# Altium schematic sheet Signal-Isolation-Section.SchDoc
size A4; DocumentNumber: 8; SheetNumber: 8; SheetTotal: 10
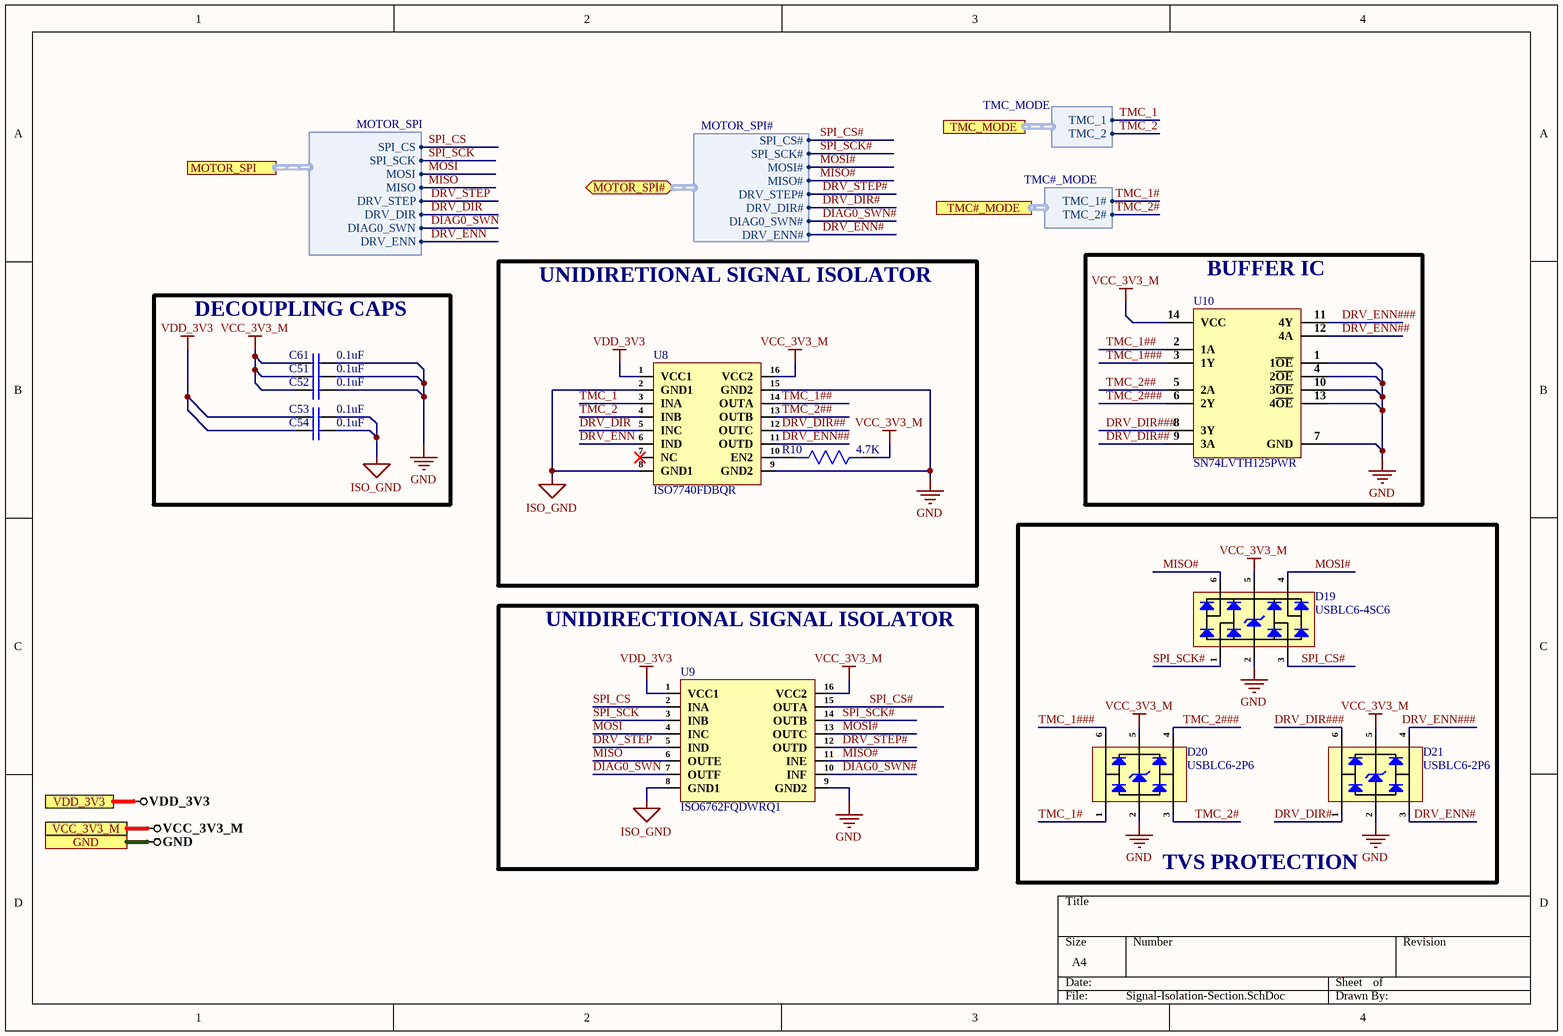
[diagram p0: Signal-Isolation-Section.SchDoc]

## Parts
C51  0.1uF  [Cap 0603]
C52  0.1uF  [Cap 0603]
C53  0.1uF  [Cap 0603]
C54  0.1uF  [Cap 0603]
C61  0.1uF  [Cap 0603]
D19  USBLC6-4SC6  [SOT-23-6]
D20  USBLC6-2P6  [SOT-666]
D21  USBLC6-2P6  [SOT-666]
R10  4.7K  [Res-0201]
U8  ISO7740FDBQR  [16-SSOP]
U9  ISO6762FQDWRQ1  [16-SOIC]
U10  SN74LVTH125PWR  [SN74LVTH125PWR]

## Blocks framed on the sheet
DECOUPLING CAPS: C51-C54 C61
UNIDIRETIONAL SIGNAL ISOLATOR: R10 U8
BUFFER IC: U10
TVS PROTECTION: D19-D21
UNIDIRECTIONAL SIGNAL ISOLATOR: U9

## Ports
GND, MOTOR_SPI (harness MOTOR_SPI), MOTOR_SPI# (bidir, harness MOTOR_SPI#), TMC#_MODE (harness TMC#_MODE), TMC_MODE (harness TMC_MODE), VCC_3V3_M, VDD_3V3

## Harnesses
MOTOR_SPI: SPI_CS, SPI_SCK, MOSI, MISO, DRV_STEP, DRV_DIR, DRV_ENN, DIAG0_SWN
MOTOR_SPI#: SPI_CS#, SPI_SCK#, MOSI#, MISO#, DRV_STEP#, DRV_DIR#, DIAG0_SWN#, DRV_ENN#
TMC_MODE: TMC_1, TMC_2
TMC#_MODE: TMC_1#, TMC_2#

## Nets
GND: C51.2 C52.2 C61.2 D19.2(GND) D20.2(GND) D21.2(GND) U8.9(GND2) U8.15(GND2) U9.9(GND2) U10.1(1~{OE}) U10.4(2~{OE}) U10.7(GND) U10.10(3~{OE}) U10.13(4~{OE}) ; port GND
ISO_GND: C53.2 C54.2 U8.2(GND1) U8.8(GND1) U9.8(GND1)
VCC_3V3_M: C51.1 C52.1 C61.1 D19.5(VBUS) D20.5(VBUS) D21.5(VBUS) R10.1 U8.16(VCC2) U9.16(VCC2) U10.14(VCC) ; port VCC_3V3_M
VDD_3V3: C53.1 C54.1 U8.1(VCC1) U9.1(VCC1) ; port VDD_3V3
DIAG0_SWN: U9.7(OUTF) ; port MOTOR_SPI.DIAG0_SWN
DIAG0_SWN#: U9.10(INF) ; port MOTOR_SPI#.DIAG0_SWN#
DRV_DIR: U8.5(INC) ; port MOTOR_SPI.DRV_DIR
DRV_DIR#: D21.1(I/O1) ; port MOTOR_SPI#.DRV_DIR#
DRV_DIR##: U8.12(OUTC) U10.9(3A)
DRV_DIR###: D21.6(I/O1) U10.8(3Y)
DRV_ENN: U8.6(IND) ; port MOTOR_SPI.DRV_ENN
DRV_ENN#: D21.3(I/O2) ; port MOTOR_SPI#.DRV_ENN#
DRV_ENN##: U8.11(OUTD) U10.12(4A)
DRV_ENN###: D21.4(I/O2) U10.11(4Y)
DRV_STEP: U9.5(IND) ; port MOTOR_SPI.DRV_STEP
DRV_STEP#: U9.12(OUTD) ; port MOTOR_SPI#.DRV_STEP#
MISO: U9.6(OUTE) ; port MOTOR_SPI.MISO
MISO#: D19.6(I/O4) U9.11(INE) ; port MOTOR_SPI#.MISO#
MOSI: U9.4(INC) ; port MOTOR_SPI.MOSI
MOSI#: D19.4(I/O3) U9.13(OUTC) ; port MOTOR_SPI#.MOSI#
SPI_CS: U9.2(INA) ; port MOTOR_SPI.SPI_CS
SPI_CS#: D19.3(I/O2) U9.15(OUTA) ; port MOTOR_SPI#.SPI_CS#
SPI_SCK: U9.3(INB) ; port MOTOR_SPI.SPI_SCK
SPI_SCK#: D19.1(I/O1) U9.14(OUTB) ; port MOTOR_SPI#.SPI_SCK#
TMC_1: U8.3(INA) ; port TMC_MODE.TMC_1
TMC_1#: D20.1(I/O1) ; port TMC#_MODE.TMC_1#
TMC_1##: U8.14(OUTA) U10.2(1A)
TMC_1###: D20.6(I/O1) U10.3(1Y)
TMC_2: U8.4(INB) ; port TMC_MODE.TMC_2
TMC_2#: D20.3(I/O2) ; port TMC#_MODE.TMC_2#
TMC_2##: U8.13(OUTB) U10.5(2A)
TMC_2###: D20.4(I/O2) U10.6(2Y)
NetR10_2: R10.2 U8.10(EN2)

Not connected (* = marked no-connect by the designer): U8 7(NC)*

## Library data of the parts
C51-C54 C61 = CL10B104KB8NNNC: Cap Ceramic 0.1uF 50VDC X7R 10% SMD 0603 Paper T/R; Manufacturer: Samsung; Capacitance: 100nF; Voltage Rating: 50V; Supplier 1: Digi-Key; Manufacturer Part Number: CL10B104KB8NNNC; RoHS: Yes; Category: Ceramic Capacitors; Stock 1: 3998791; Pricing 1: 1=0.10000, 10=0.03000, 50=0.01640, 100=0.01340, 500=0.00954, 1000=0.00750 (USD); Mount: Surface Mount; Case/Package: 0603; Case Code (Metric): 1608; Case Code (Imperial): 0603; Material: Ceramic; Contact Plating: Tin; Min Operating Temperature: -55°C; Max Operating Temperature: 125°C; Dielectric: X7R; Tolerance: 10%; Package Quantity: 1; Packaging: Tape and Reel; Voltage: 50V; Voltage Rating (DC): 50V; Series: CL; Construction: Flat; Length: 1.6mm; Width: 0.031inch; Height: 0.8mm; Depth: 0.8mm; Thickness: 0.035inch; Radiation Hardening: No; Lead Free: Lead Free; RoHS Compliant: Yes; ComponentLink1URL: https://datasheet.ciiva.com/25803/cl10b104kb8nnnc-25803393.pdf?src-supplier=Digi-Key; ComponentLink1Description: https://datasheet.ciiva.com/25803/cl10b104kb8nnnc-25803393.pdf?src-supplier=Digi-Key; ComponentLink2URL: https://datasheet.ciiva.com/26838/getdatasheetpartid-89097-26838411.pdf?src-supplier=Verical; ComponentLink2Description: https://datasheet.ciiva.com/26838/getdatasheetpartid-89097-26838411.pdf?src-supplier=Verical; ComponentLink3URL: https://datasheet.ciiva.com/29198/456651-da-01-en-vs-kondensator-0605-29198839.pdf?src-supplier=Conrad; ComponentLink3Description: https://datasheet.ciiva.com/29198/456651-da-01-en-vs-kondensator-0605-29198839.pdf?src-supplier=Conrad; Supplier Part Number 1: 1276-1000-1-ND
D19 = USBLC6-4SC6: TVS DIODE 5.25VWM 17VC SOT23-6; Item Type: ESD Diode; Value: 4pF; Direction: Unidirectional; Reverse Standoff Voltage: 5V; Min Breakdown Voltage: 6V; Power Line Protection: Yes; Peak Pulse Current: 5A; Number of Elements: 1; Operating Supply Voltage: 860mV; Number of Channels: 4; Clamping Voltage: 17V; Polarity: Unidirectional,Bidirectional; Leakage Current: 150nA; Test Current: 1mA; Max Breakdown Voltage: 10V; Max Reverse Leakage Current: 2uA; LCSC Part Number: C111212; ComponentLink1Description: LCSC; Supplier: Mouser; Supplier Part Number: 511-USBLC6-4SC6; RoHS: Yes; Category: TVS Diodes; Stock: 148069; Pricing: 1=0.58, 10=0.512, 50=0.512, 100=0.381, 1000=0.271, 10000=0.211 (USD); Mounting Technology: Surface Mount; Case/Package: SOT-23; Pins: 6; Min Operating Temperature: -40°C; Max Operating Temperature: 125°C; Packaging: Tape and Reel; Series: USB; Reverse Breakdown Voltage: 6V; Breakdown Voltage: 6V; Termination: SMD/SMT; Working Voltage: 5V; ESD Protection: Yes; Voltage Rating (DC): 5V; Clamping Voltage-Max: 17V; Number of Unidirectional Channels: 4; Length: 3.05mm; Width: 1.75mm; Height: 1.3mm; Depth: 1.75mm; Radiation Hardening: No; Lead Free: Lead Free; RoHS Compliant: Yes; Reach SVHC Compliant: No; ComponentLink2URL: https://datasheet.ciiva.com/14186/usblc6-4-st-eng-tds-14186570.pdf?src-supplier=Distrelec; ComponentLink2Description: https://datasheet.ciiva.com/14186/usblc6-4-st-eng-tds-14186570.pdf?src-supplier=Distrelec; ComponentLink3URL: https://datasheet.ciiva.com/27052/1493951-27052291.pdf?src-supplier=Jameco; ComponentLink3Description: https://datasheet.ciiva.com/27052/1493951-27052291.pdf?src-supplier=Jameco; ComponentLink4URL: https://datasheet.ciiva.com/1220/48344-1220005.pdf?src-supplier=Newark; ComponentLink4Description: https://datasheet.ciiva.com/1220/48344-1220005.pdf?src-supplier=Newark; ComponentLink5URL: https://datasheet.ciiva.com/4507/cd00047494-112581-4507757.pdf?src-supplier=Mouser; ComponentLink5Description: https://datasheet.ciiva.com/4507/cd00047494-112581-4507757.pdf?src-supplier=Mouser; ComponentLink6URL: https://datasheet.ciiva.com/16206/cd00047494-16206119.pdf?src-supplier=Future+Electronics; ComponentLink6Description: https://datasheet.ciiva.com/16206/cd00047494-16206119.pdf?src-supplier=Future+Electronics; ComponentLink7URL: https://datasheet.ciiva.com/15143/getdatasheetpartid-88767-15143364.pdf?src-supplier=Verical; ComponentLink7Description: https://datasheet.ciiva.com/15143/getdatasheetpartid-88767-15143364.pdf?src-supplier=Verical; ComponentLink8URL: https://datasheet.ciiva.com/22685/1498406-22685833.pdf?src-supplier=Element14; ComponentLink8Description: https://datasheet.ciiva.com/22685/1498406-22685833.pdf?src-supplier=Element14; ComponentLink9URL: https://datasheet.ciiva.com/22692/1498406-22692454.pdf?src-supplier=Element14; ComponentLink9Description: https://datasheet.ciiva.com/22692/1498406-22692454.pdf?src-supplier=Element14
D20 D21 = USBLC6-2P6: TVS DIODE 5.25VWM 17VC SOT666; Item Type: ESD Diode; Direction: Unidirectional,Bidirectional; Operating Supply Voltage: 5V; Number of Elements: 1; Value: 3.5pF; Reverse Breakdown Voltage: 6V; Number of Channels: 2; Clamping Voltage: 17V; Power Line Protection: Yes; Test Current: 1mA; Max Reverse Leakage Current: 150nA; Peak Pulse Current: 5A; Max Repetitive Reverse Voltage (Vrrm): 5.25V; LCSC Part Number: C15999; ComponentLink1Description: LCSC; Supplier: Mouser; Supplier Part Number: 511-USBLC6-2P6; RoHS: Yes; Category: TVS Diodes; Stock: 180020; Pricing: 1=0.59, 10=0.514, 50=0.514, 100=0.356, 1000=0.253, 10000=0.197 (USD); Mounting Technology: Surface Mount; Case/Package: SOT-666; Pins: 6; Min Operating Temperature: -40°C; Max Operating Temperature: 125°C; Package Quantity: 1; Packaging: Tape and Reel; Number of Bidirectional Channels: 2; Reverse Standoff Voltage: 5V; Min Breakdown Voltage: 6V; Polarity: Unidirectional,Bidirectional; Breakdown Voltage: 6V; Termination: SMD/SMT; Working Voltage: 5V; ESD Protection: Yes; Leakage Current: 150nA; Max Breakdown Voltage: 6V; Series: USB; Clamping Voltage-Max: 17V; Number of Unidirectional Channels: 2; Length: 1.7mm; Width: 1.3mm; Height: 0.6mm; Depth: 1.3mm; Radiation Hardening: No; Reach SVHC Compliant: No; Lead Free: Lead Free; RoHS Compliant: Yes; ComponentLink2URL: https://datasheet.ciiva.com/14186/usblc6-2-st-eng-tds-14186568.pdf?src-supplier=Distrelec; ComponentLink2Description: https://datasheet.ciiva.com/14186/usblc6-2-st-eng-tds-14186568.pdf?src-supplier=Distrelec; ComponentLink3URL: https://datasheet.ciiva.com/15143/getdatasheetpartid-98673-15143462.pdf?src-supplier=Verical; ComponentLink3Description: https://datasheet.ciiva.com/15143/getdatasheetpartid-98673-15143462.pdf?src-supplier=Verical; ComponentLink4URL: https://datasheet.ciiva.com/22685/1690354-22685832.pdf?src-supplier=Element14; ComponentLink4Description: https://datasheet.ciiva.com/22685/1690354-22685832.pdf?src-supplier=Element14; ComponentLink5URL: https://datasheet.ciiva.com/22692/1690354-22692453.pdf?src-supplier=Element14; ComponentLink5Description: https://datasheet.ciiva.com/22692/1690354-22692453.pdf?src-supplier=Element14; ComponentLink6URL: https://datasheet.ciiva.com/4508/cd00050750-4508892.pdf?src-supplier=Mouser; ComponentLink6Description: https://datasheet.ciiva.com/4508/cd00050750-4508892.pdf?src-supplier=Mouser; ComponentLink7URL: https://datasheet.ciiva.com/16378/cd00050750-16378714.pdf?src-supplier=Future+Electronics; ComponentLink7Description: https://datasheet.ciiva.com/16378/cd00050750-16378714.pdf?src-supplier=Future+Electronics; ComponentLink8URL: https://datasheet.ciiva.com/41444/001184108-da-01-en-ic-esd-protection-usblc6-2p6-sot-666-stm-41444134.pdf?src-supplier=Conrad; ComponentLink8Description: https://datasheet.ciiva.com/41444/001184108-da-01-en-ic-esd-protection-usblc6-2p6-sot-666-stm-41444134.pdf?src-supplier=Conrad
R10 = RC0201FR-074K7L: RES SMD 4.7K OHM 1% 1/20W 0201; Manufacturer: Yageo; Resistance: 4.7kR; Temperature Coefficient: 200ppm/°C; Power Rating: 50mW; Voltage Rating: 25V; Supplier 1: Digi-Key; Manufacturer Part Number: RC0201FR-074K7L; Stock 1: 2128413; Pricing 1: 1=0.1, 10=0.04, 100=0.0165, 1000=0.00739, 2500=0.00642, 5000=0.0053 (USD); Case/Package: 0201; Weight: 6E-06oz; Contact Plating: Tin,Matte; Case Code (Metric): 0603; Case Code (Imperial): 0201; Min Operating Temperature: -55°C; Max Operating Temperature: 125°C; Tolerance: 1%; Composition: Thick Film; Packaging: Tape and Reel; Package Quantity: 1; Number of Terminations: 2; Termination: SMD/SMT; Military Standard: Not; Max Power Dissipation: 50mW; Features: Moisture Resistant; Length: 0.6mm; Height: 0.01inch; Width: 0.012inch; Depth: 0.3mm; Radiation Hardening: No; REACH SVHC: Unknown; Lead Free: Lead Free; ComponentLink1URL: http://www.yageo.com/documents/recent/PYu-RC_Group_51_RoHS_L_10.pdf?src-supplier=Digi-Key; ComponentLink1Description: http://www.yageo.com/documents/recent/PYu-RC_Group_51_RoHS_L_10.pdf?src-supplier=Digi-Key; ComponentLink2URL: http://www.farnell.com/datasheets/2167052.pdf?src-supplier=Element14; ComponentLink2Description: http://www.farnell.com/datasheets/2167052.pdf?src-supplier=Element14; ComponentLink3URL: http://www.yageo.com/documents/recent/PYu-RC0201_51_RoHS_L_8.pdf?src-supplier=Avnet+Europe; ComponentLink3Description: http://www.yageo.com/documents/recent/PYu-RC0201_51_RoHS_L_8.pdf?src-supplier=Avnet+Europe; ComponentLink4URL: http://www.yageo.com/documents/recent/PYu-RC0201_51_RoHS_L_8.pdf?src-supplier=Avnet; ComponentLink4Description: http://www.yageo.com/documents/recent/PYu-RC0201_51_RoHS_L_8.pdf?src-supplier=Avnet; Supplier Part Number 1: 311-4.70KMCT-ND
U8 = ISO7740FDBQR: DGTL ISO 3000VRMS 4CH GP 16SSOP; Item Type: IC; LCSC Part Number: C544482; ComponentLink1Description: LCSC; Supplier: Mouser; Supplier Part Number: 595-ISO7740FDBQR; RoHS: Yes; Category: Integrated Circuits (ICs); Stock: 3733; Pricing: 1=2.67, 10=2.34, 50=2.34, 100=1.95, 1000=1.47, 10000=1.2 (USD); ComponentLink2URL: http://www.ti.com/general/docs/suppproductinfo.tsp?distId=10&amp;gotoUrl=http%3A%2F%2Fwww.ti.com%2Flit%2Fgpn%2Fiso7742&src-supplier=Digi-Key; ComponentLink2Description: http://www.ti.com/general/docs/suppproductinfo.tsp?distId=10&amp;gotoUrl=http%3A%2F%2Fwww.ti.com%2Flit%2Fgpn%2Fiso7742&src-supplier=Digi-Key; ComponentLink3URL: http://www.ti.com/lit/ds/symlink/iso7742.pdf?src-supplier=Digi-Key; ComponentLink3Description: http://www.ti.com/lit/ds/symlink/iso7742.pdf?src-supplier=Digi-Key
U9 = ISO6762FQDWRQ1: AUTOMOTIVE, GENERAL-PURPOSE, 50-; Item Type: IC; LCSC Part Number: C5216383; ComponentLink1Description: LCSC; Supplier: Mouser; Supplier Part Number: 595-ISO6762FQDWRQ1; RoHS: No; Category: Integrated Circuits (ICs); Stock: 8302; Pricing: 1=3.36, 10=2.94, 50=2.94, 100=2.48, 1000=1.78, 10000=1.77 (USD)
U10 = SN74LVTH125PWR: IC BUS BUFFER TRI-ST QD 14TSSOP; Manufacturer: Texas Instruments; Logic Function: Buffer,Inverting; Polarity: Non-Inverting; Propagation Delay: 2.1ns; Min Supply Voltage: 2.7V; Max Supply Voltage: 3.6V; Number of Channels: 4; Operating Supply Voltage: 3.3V; Number of Bits per Element: 1; High Level Output Current: -32mA; Low Level Output Current: 64mA; Quiescent Current: 7mA; Number of Output Lines: 3; Supplier 1: Digi-Key; Manufacturer Part Number: SN74LVTH125PWR; RoHS: Yes; Category: Logic Gates; Stock 1: 980; Pricing 1: 1=0.64000, 10=0.56000, 25=0.52560, 100=0.42910, 250=0.39856, 500=0.33920, 1000=0.28000 (USD); Mount: Surface Mount; Case/Package: TSSOP; Number of Pins: 14; Contact Plating: Gold; Min Operating Temperature: -40°C; Max Operating Temperature: 85°C; Packaging: Tape and Reel; Number of Outputs: 4; Package Quantity: 2000; Number of Elements: 4; Turn-On Delay Time: 2.1ns; Number of Bits: 4; Number of Inputs: 4; Number of Input Lines: 4; Number of Gates: 4; Output Current: 64mA; Length: 5mm; Width: 4.4mm; Height: 1.15mm; Radiation Hardening: No; Lead Free: Lead Free; RoHS Compliant: Yes; REACH SVHC: No SVHC; ComponentLink1URL: https://datasheet.ciiva.com/41455/001017258-da-01-en-ic-bus-buf-q-sn74lvth125pwr-tssop-14-tid-41455824.pdf?src-supplier=Conrad; ComponentLink1Description: https://datasheet.ciiva.com/41455/001017258-da-01-en-ic-bus-buf-q-sn74lvth125pwr-tssop-14-tid-41455824.pdf?src-supplier=Conrad; ComponentLink2URL: https://datasheet.ciiva.com/46442/1764295-46442090.pdf?src-supplier=Element14; ComponentLink2Description: https://datasheet.ciiva.com/46442/1764295-46442090.pdf?src-supplier=Element14; ComponentLink3URL: https://datasheet.ciiva.com/1834/sn74lvth125-1834408.pdf?src-supplier=Digi-Key; ComponentLink3Description: https://datasheet.ciiva.com/1834/sn74lvth125-1834408.pdf?src-supplier=Digi-Key; ComponentLink4URL: https://datasheet.ciiva.com/1834/sn74lvth125-1834407.pdf?src-supplier=Digi-Key; ComponentLink4Description: https://datasheet.ciiva.com/1834/sn74lvth125-1834407.pdf?src-supplier=Digi-Key; ComponentLink5URL: https://datasheet.ciiva.com/7795/sn74lvth125-7795066.pdf?src-supplier=Element14; ComponentLink5Description: https://datasheet.ciiva.com/7795/sn74lvth125-7795066.pdf?src-supplier=Element14; ComponentLink6URL: https://datasheet.ciiva.com/14301/scbs703i-14301146.pdf?src-supplier=Avnet; ComponentLink6Description: https://datasheet.ciiva.com/14301/scbs703i-14301146.pdf?src-supplier=Avnet; ComponentLink7URL: https://datasheet.ciiva.com/26263/sn74lvth125-26263836.pdf?src-supplier=Avnet+Europe; ComponentLink7Description: https://datasheet.ciiva.com/26263/sn74lvth125-26263836.pdf?src-supplier=Avnet+Europe; Supplier Part Number 1: 296-8660-1-ND